# Altium schematic sheet CUK_3Ph_dig_iso_interface.SchDoc
size A
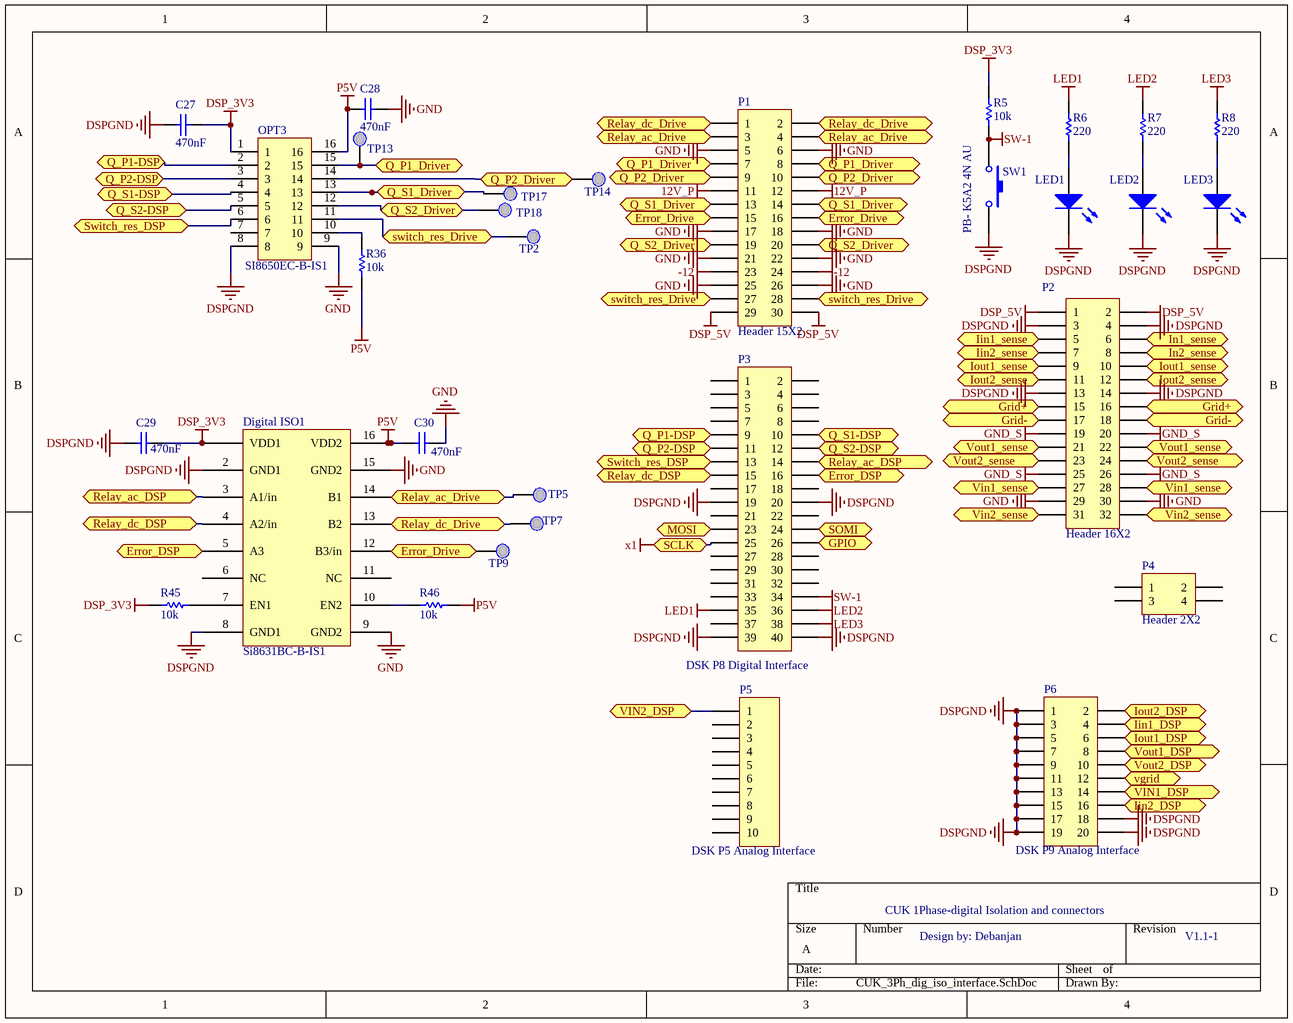
[diagram p0: CUK_3Ph_dig_iso_interface.SchDoc]

## Parts
C27  value 470nF  [Capacitor 0805]  (hidden comment: Cap)
C28  value 470nF  [Capacitor 0805]  (hidden comment: Cap)
C29  value 470nF  [Capacitor 0805]  (hidden comment: Cap)
C30  value 470nF  [Capacitor 0805]  (hidden comment: Cap)
Digital_ISO1  Si8631BC-B-IS1  [SOIC16 Narrow width]
LED1  ON  [LED 0805]  (value not drawn)
LED2  ON  [LED 0805]  (value not drawn)
LED3  ON  [LED 0805]  (value not drawn)
OPT3  SI8650EC-B-IS1  [SOIC16pin]
P1  Header 15X2  [HDR2X15]
P2  Header 16X2  [HDR2X16]
P3  DSK P8 Digital Interface  [HDR2X20]
P4  Header 2X2  [HDR2X2]
P5  DSK P5 Analog Interface  [HDR1X10]
P6  DSK P9 Analog Interface  [HDR2X10]
R5  value 10k  [0805 RES]  (hidden comment: Res1)
R6  value 220  [0805 RES]  (hidden comment: Res1)
R7  value 220  [0805 RES]  (hidden comment: Res1)
R8  value 220  [0805 RES]  (hidden comment: Res1)
R36  value 10k  [0805 RES]  (hidden comment: Res1)
R45  value 10k  [0805 RES]  (hidden comment: Res1)
R46  value 10k  [0805 RES]  (hidden comment: Res1)
SW1  PB- K5A2 4N AU  [push button]
TP2  Test point  [Test Point]  (value not drawn)
TP5  Test point  [Test Point]  (value not drawn)
TP7  Test point  [Test Point]  (value not drawn)
TP9  Test point  [Test Point]  (value not drawn)
TP13  Test point  [Test Point]  (value not drawn)
TP14  Test point  [Test Point]  (value not drawn)
TP17  Test point  [Test Point]  (value not drawn)
TP18  Test point  [Test Point]  (value not drawn)

## Ports
Error_Drive (bidir), Error_DSP (bidir), GPIO, Grid+, Grid-, Iin1_DSP, Iin1_sense, Iin2_DSP, Iin2_sense, In1_sense, In2_sense, Iout1_DSP, Iout1_sense, Iout1_sense (bidir), Iout2_DSP, Iout2_sense (bidir), MOSI, Q_P1-DSP, Q_P1_Driver, Q_P2-DSP, Q_P2_Driver, Q_S1-DSP, Q_S1_Driver, Q_S2-DSP, Q_S2_Driver, Relay_ac_Drive, Relay_ac_DSP, Relay_dc_Drive, Relay_dc_DSP, SCLK, SOMI, switch_res_Drive, Switch_res_DSP, vgrid (bidir), VIN1_DSP, Vin1_sense, VIN2_DSP, Vin2_sense, Vout1_DSP, Vout1_sense, Vout2_DSP, Vout2_sense

## Nets
12V_P: P1.11 P1.12
-12: P1.23 P1.24
DSP_3V3: C27.1 C29.1 Digital_ISO1.1(VDD1) OPT3.1 R5.1 R45.1
DSP_5V: P1.29 P1.30 P2.1 P2.2
DSPGND: C27.2 C29.2 Digital_ISO1.2(GND1) Digital_ISO1.8(GND1) LED1.2(K) LED2.2(K) LED3.2(K) OPT3.8 P2.3 P2.4 P2.13 P2.14 P3.19 P3.20 P3.39 P3.40 P6.1 P6.3 P6.5 P6.7 P6.9 P6.11 P6.13 P6.15 P6.17 P6.18 P6.19 P6.20 SW1.2
GND: C28.2 C30.2 Digital_ISO1.9(GND2) Digital_ISO1.15(GND2) OPT3.9 P1.5 P1.6 P1.17 P1.18 P1.21 P1.22 P1.25 P1.26 P2.29 P2.30
GND_S: P2.19 P2.20 P2.25 P2.26
LED1: P3.35 R6.1
LED2: P3.36 R7.1
LED3: P3.38 R8.1
P5V: C28.1 C30.1 Digital_ISO1.16(VDD2) OPT3.16 R36.1 R46.2
SW-1: P3.34 R5.2 SW1.1
x1: P3.25 ; port SCLK
Error_Drive: Digital_ISO1.12(B3/in) P1.15 P1.16 TP9.1 ; port Error_Drive
Error_DSP: Digital_ISO1.5(A3) P3.16 ; port Error_DSP
GPIO: P3.26 ; port GPIO
Grid+: P2.15 P2.16 ; port Grid+
Grid-: P2.17 P2.18 ; port Grid-
Iin1_DSP: P6.4 ; port Iin1_DSP
Iin1_sense: P2.5 ; port Iin1_sense
Iin2_DSP: P6.16 ; port Iin2_DSP
Iin2_sense: P2.7 ; port Iin2_sense
In1_sense: P2.6 ; port In1_sense
In2_sense: P2.8 ; port In2_sense
Iout1_DSP: P6.6 ; port Iout1_DSP
Iout1_sense: P2.9 P2.10 ; port Iout1_sense
Iout2_DSP: P6.2 ; port Iout2_DSP
Iout2_sense: P2.11 P2.12 ; port Iout2_sense
MOSI: P3.23 ; port MOSI
Q_P1-DSP: OPT3.2 P3.9 ; port Q_P1-DSP
Q_P1_Driver: OPT3.15 P1.7 P1.8 TP13.1 ; port Q_P1_Driver
Q_P2-DSP: OPT3.3 P3.11 ; port Q_P2-DSP
Q_P2_Driver: OPT3.14 P1.9 P1.10 TP14.1 ; port Q_P2_Driver
Q_S1-DSP: OPT3.4 P3.10 ; port Q_S1-DSP
Q_S1_Driver: OPT3.13 P1.13 P1.14 TP17.1 ; port Q_S1_Driver
Q_S2-DSP: OPT3.5 P3.12 ; port Q_S2-DSP
Q_S2_Driver: OPT3.12 P1.19 P1.20 TP18.1 ; port Q_S2_Driver
Relay_ac_Drive: Digital_ISO1.14(B1) P1.3 P1.4 TP5.1 ; port Relay_ac_Drive
Relay_ac_DSP: Digital_ISO1.3(A1/in) P3.14 ; port Relay_ac_DSP
Relay_dc_Drive: Digital_ISO1.13(B2) P1.1 P1.2 TP7.1 ; port Relay_dc_Drive
Relay_dc_DSP: Digital_ISO1.4(A2/in) P3.15 ; port Relay_dc_DSP
SOMI: P3.24 ; port SOMI
switch_res_Drive: OPT3.11 P1.27 P1.28 TP2.1 ; port switch_res_Drive
Switch_res_DSP: OPT3.6 P3.13 ; port Switch_res_DSP
vgrid: P6.12 ; port vgrid
VIN1_DSP: P6.14 ; port VIN1_DSP
Vin1_sense: P2.27 P2.28 ; port Vin1_sense
VIN2_DSP: P5.1 ; port VIN2_DSP
Vin2_sense: P2.31 P2.32 ; port Vin2_sense
Vout1_DSP: P6.8 ; port Vout1_DSP
Vout1_sense: P2.21 P2.22 ; port Vout1_sense
Vout2_DSP: P6.10 ; port Vout2_DSP
Vout2_sense: P2.23 P2.24 ; port Vout2_sense
NetDigital_ISO1_7: Digital_ISO1.7(EN1) R45.2
NetDigital_ISO1_10: Digital_ISO1.10(EN2) R46.1
NetLED1_1: LED1.1(A) R6.2
NetLED2_1: LED2.1(A) R7.2
NetLED3_1: LED3.1(A) R8.2
NetOPT3_10: OPT3.10 R36.2

Not connected (* = marked no-connect by the designer): Digital_ISO1 6(NC) 11(NC); OPT3 7; P3 1 2 3 4 5 6 7 8 17 18 21 22 27 28 29 30 31 32 33 37; P4 1 2 3 4; P5 2 3 4 5 6 7 8 9 10

## Notes on the sheet
- CUK 1Phase-digital Isolation and connectors
- Design by: Debanjan
- V1.1-1

## Library data of the parts
C27-C30 = Cap: Capacitor; Published: 8-Jun-2000; LatestRevisionDate: 17-Jul-2002; LatestRevisionNote: Re-released for DXP Platform.; PackageReference: RAD-0.3; Publisher: Altium Limited
Digital_ISO1 = Digital Isolator 2/1
LED1-LED3 = LED3: Typical BLUE SiC LED; Published: 8-Jun-2000; LatestRevisionDate: 17-Dec-2003; LatestRevisionNote: PCB Footprint replaced.; DatasheetDocument: 16-Apr-2002; PackageDocument: 16-Apr-2002; PackageReference: 3.5X2.8X1.9; Publisher: Altium Limited
OPT3 = digital isolator 16 pin
P1 = Header 15X2: Header, 15-Pin, Dual row; LatestRevisionDate: 17-Jul-2002; LatestRevisionNote: Re-released for DXP Platform.; Publisher: Altium Limited
P2 = Header 16X2: Header, 16-Pin, Dual row; LatestRevisionDate: 17-Jul-2002; LatestRevisionNote: Re-released for DXP Platform.; Publisher: Altium Limited
P3 = Header 20X2: Header, 20-Pin, Dual row; LatestRevisionDate: 17-Jul-2002; LatestRevisionNote: Re-released for DXP Platform.; Publisher: Altium Limited
P4 = Header 2X2: Header, 2-Pin, Dual row; LatestRevisionDate: 17-Jul-2002; LatestRevisionNote: Re-released for DXP Platform.; Publisher: Altium Limited
P5 = Header 10: Header, 10-Pin; LatestRevisionDate: 17-Jul-2002; LatestRevisionNote: Re-released for DXP Platform.; Publisher: Altium Limited
P6 = Header 10X2: Header, 10-Pin, Dual row; LatestRevisionDate: 17-Jul-2002; LatestRevisionNote: Re-released for DXP Platform.; Publisher: Altium Limited
R5-R8 R36 R45 R46 = Res1: Resistor; Published: 8-Jun-2000; Revision: July-2002: Re-released for DXP Platform.; Publisher: Altium Limited
SW1 = SW-PB: Switch; Published: 24-Mar-1999; Revision: July-2002: Re-released for DXP Platform.; Publisher: Altium Limited